# Altium schematic sheet temp1.robcon.powerboard.sche in out.SchDoc
size A4; SheetNumber: 2; SheetTotal: 2
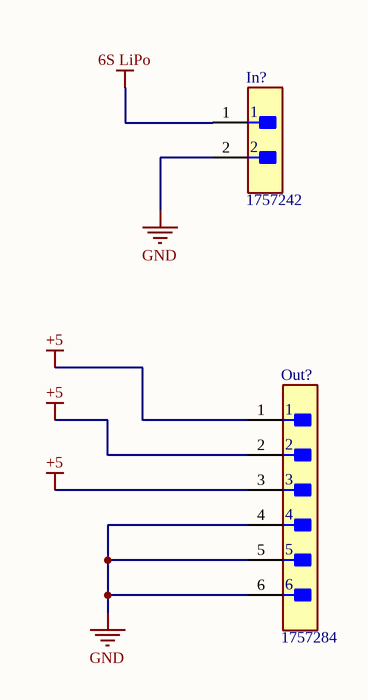
[diagram p0: temp1.robcon.powerboard.sche in out.SchDoc]

## Parts
In?  1757242  [FP-1757242-MFG]
Out?  1757284  [FP-1757284-MFG]

## Nets
6S LiPo: In?.1
+5: Out?.1 Out?.2 Out?.3
GND: In?.2 Out?.4 Out?.5 Out?.6

## Library data of the parts
In? = CMP-09399-000010-1: TERM BLOCK HDR 2POS 90DEG 5.08MM; Number of Poles: 2; Voltage Rating (DC): 320V; Number of Levels: 1; Voltage Rating: 250V; Current: 15A; Gender: Male; Current Rating: 12A; Voltage: 300V; Approvals: UL; Connector Type: Plug; Package Quantity: 50; Weight: 5.396916oz; Mount: Through Hole; Lead Free: Lead Free; Depth: 12mm; Contact Plating: Tin; Housing Material: PBT; Color: Grey; REACH SVHC: No SVHC; Number of Contacts: 2; Flammability Rating: UL94 V-0; Length: 12.16mm; Housing Color: Green; RoHS Compliant: Yes; Contact Material: Tin; Height: 12.08mm; Orientation: Right Angle; Termination: Solder; Pitch: 5.08mm; Number of Positions: 2; Packaging: Bulk; Number of Rows: 1; Number of Positions Per Level: 2; Width: 12.1mm; Max Current Rating: 12A; Series: MSTBA
Out? = CMP-09399-000007-1: TERM BLOCK HDR 6POS 90DEG 5.08MM; Gender: Male; Voltage Rating: 250V; Max Current Rating: 12A; Number of Positions: 6; Current: 15A; Approvals: UL; Number of Levels: 1; Voltage: 300V; Voltage Rating (DC): 320V; Connector Type: Plug; Termination: Solder; Weight: 5.396916oz; Flammability Rating: UL94 V-0; Packaging: Bulk; Package Quantity: 50; Contact Plating: Tin; REACH SVHC: No SVHC; Color: Grey; Current Rating: 12A; Mount: Through Hole; Height: 12.1mm; Number of Rows: 1; Number of Contacts: 6; Housing Material: Polybutylene; Series: MSTBA; Pitch: 5.08mm; RoHS Compliant: Yes; Orientation: Right Angle; Housing Color: Green; Length: 32.48mm; Number of Positions Per Level: 6; Width: 32.4mm; Depth: 12mm; Lead Free: Lead Free; Contact Material: Tin; Number of Poles: 6